# Altium schematic sheet CPU-board-Sheet3-multi.SchDoc
size A3; SheetNumber: 3
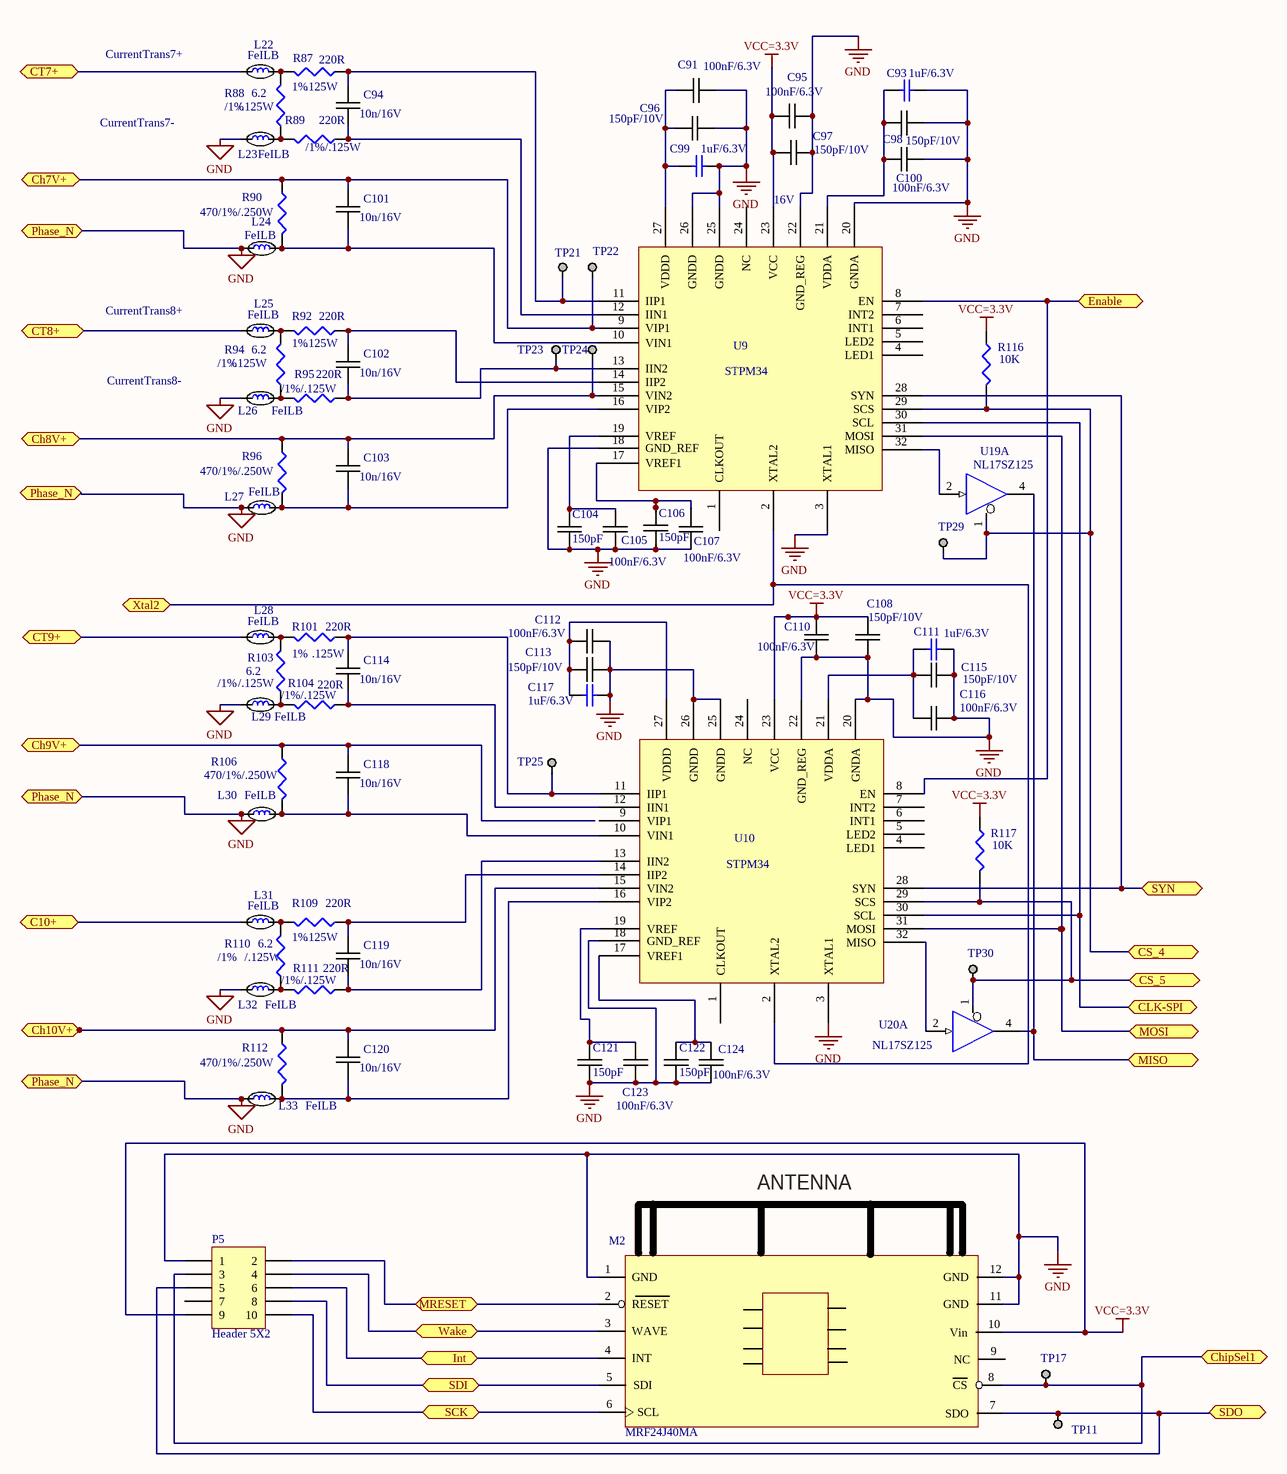
[diagram p0: CPU-board-Sheet3-multi.SchDoc]

## Parts
C91  100nF/6.3V  [0402C-GENERIC]
C93  1uF/6.3V  [0402C-GENERIC]
C94  10n/16V  [0402C-GENERIC]
C95  100nF/6.3V  [0402C-GENERIC]
C96  150pF/10V  [0402C-GENERIC]
C97  150pF/10V  [0402C-GENERIC]
C98  150pF/10V  [0402C-GENERIC]
C99  1uF/6.3V  [0402C-GENERIC]
C100  100nF/6.3V  [0402C-GENERIC]
C101  10n/16V  [0402C-GENERIC]
C102  10n/16V  [0402C-GENERIC]
C103  10n/16V  [0402C-GENERIC]
C104  150pF  [0402C-GENERIC]
C105  100nF/6.3V  [0402C-GENERIC]
C106  150pF  [0402C-GENERIC]
C107  100nF/6.3V  [0402C-GENERIC]
C108  150pF/10V  [0402C-GENERIC]
C110  100nF/6.3V  [0402C-GENERIC]
C111  1uF/6.3V  [0402C-GENERIC]
C112  100nF/6.3V  [0402C-GENERIC]
C113  150pF/10V  [0402C-GENERIC]
C114  10n/16V  [0402C-GENERIC]
C115  150pF/10V  [0402C-GENERIC]
C116  100nF/6.3V  [0402C-GENERIC]
C117  1uF/6.3V  [0402C-GENERIC]
C118  10n/16V  [0402C-GENERIC]
C119  10n/16V  [0402C-GENERIC]
C120  10n/16V  [0402C-GENERIC]
C121  150pF  [0402C-GENERIC]
C122  150pF  [0402C-GENERIC]
C123  100nF/6.3V  [0402C-GENERIC]
C124  100nF/6.3V  [0402C-GENERIC]
L22  FeILB  [0603C-TBD]
L23  FeILB  [0603C-TBD]
L24  FeILB  [0603C-TBD]
L25  FeILB  [0603C-TBD]
L26  FeILB  [0603C-TBD]
L27  FeILB  [0603C-TBD]
L28  FeILB  [0603C-TBD]
L29  FeILB  [0603C-TBD]
L30  FeILB  [0603C-TBD]
L31  FeILB  [0603C-TBD]
L32  FeILB  [0603C-TBD]
L33  FeILB  [0603C-TBD]
M2  MRF24J40MA  [MRF24J40MA-zigBEE module]
P5  Header 5X2  [Header2x5 1.27mm pitch]
R87  220R  [0402R-TBD]
R88  6.2  [0402R-TBD]
R89  220R  [0402R-TBD]
R90  470/1%/.250W  [1206FB-GENERIC]
R92  220R  [0402R-TBD]
R94  6.2  [0402R-TBD]
R95  220R  [0402R-TBD]
R96  470/1%/.250W  [1206FB-GENERIC]
R101  220R  [0402R-TBD]
R103  6.2  [0402R-TBD]
R104  220R  [0402R-TBD]
R106  470/1%/.250W  [1206FB-GENERIC]
R109  220R  [0402R-TBD]
R110  6.2  [0402R-TBD]
R111  220R  [0402R-TBD]
R112  470/1%/.250W  [1206FB-GENERIC]
R116  10K  [0402C-GENERIC]
R117  10K  [0402C-GENERIC]
TP11  TESTPOINT  [TESTPOINT]  (value not drawn)
TP17  TESTPOINT  [TESTPOINT]  (value not drawn)
TP21  TESTPOINT  [TESTPOINT]  (value not drawn)
TP22  TESTPOINT  [TESTPOINT]  (value not drawn)
TP23  TESTPOINT  [TESTPOINT]  (value not drawn)
TP24  TESTPOINT  [TESTPOINT]  (value not drawn)
TP25  TESTPOINT  [TESTPOINT]  (value not drawn)
TP29  TESTPOINT  [TESTPOINT]  (value not drawn)
TP30  TESTPOINT  [TESTPOINT]  (value not drawn)
U9  STPM34  [QFN32_L]
U10  STPM34  [QFN32_L]
U19  NL17SZ125  (part A of 2)
U20  NL17SZ125  (part A of 2)

## Ports
C10+, Ch7V+, Ch8V+, Ch9V+, Ch10V+, ChipSel1, CLK-SPI, CS_4, CS_5, CT7+, CT8+, CT9+, Enable, Int, MISO, MOSI, MRESET, Phase_N, SCK, SDI, SDO, SYN, Wake, Xtal2

## Nets
GND: C91.2 C93.2 C95.2 C96.2 C97.2 C98.1 C99.2 C100.2 C104.2 C105.2 C106.2 C107.2 C108.2 C110.1 C111.2 C112.2 C113.2 C115.2 C116.2 C117.2 C121.2 C122.2 C123.2 C124.2 L23.1 L24.1 L26.1 L27.1 L29.1 L30.1 L32.1 L33.1 M2.1(GND) M2.11(GND) M2.12(GND) P5.1 U9.3(XTAL1) U9.18(GND_REF) U9.20(GNDA) U9.22(GND_REG) U9.25(GNDD) U9.26(GNDD) U10.3(XTAL1) U10.18(GND_REF) U10.20(GNDA) U10.22(GND_REG) U10.25(GNDD) U10.26(GNDD) ; port Phase_N
VCC=3.3V: C95.1 C97.1 C108.1 C110.2 M2.10(Vin) P5.9 R116.1 R117.1 U9.23(VCC) U10.23(VCC)
C10+: L31.1 ; port C10+
Ch7V+: C101.2 R90.1 TP22.1 U9.9(VIP1) ; port Ch7V+
Ch8V+: C103.2 R96.1 TP24.1 U9.15(VIN2) ; port Ch8V+
Ch9V+: C118.2 R106.1 ; port Ch9V+
Ch10V+: C120.2 R112.1 U10.15(VIN2) ; port Ch10V+
ChipSel1: M2.8(CS) P5.3 TP17.1 ; port ChipSel1
CLK-SPI: U9.30(SCL) U10.30(SCL) ; port CLK-SPI
CS_4: R116.2 TP29.1 U9.29(SCS) U19.1 ; port CS_4
CS_5: R117.2 TP30.1 U10.29(SCS) U20.1 ; port CS_5
CT7+: L22.1 ; port CT7+
CT8+: L25.1 ; port CT8+
CT9+: L28.1 ; port CT9+
Enable: U9.8(EN) U10.8(EN) ; port Enable
Int: M2.4(INT) P5.6 ; port Int
MISO: U19.4(Y) U20.4(Y) ; port MISO
MOSI: U9.31(MOSI) U10.31(MOSI) ; port MOSI
MRESET: M2.2(RESET) P5.2 ; port MRESET
SCK: M2.6(SCL) P5.10 ; port SCK
SDI: M2.5(SDI) P5.8 ; port SDI
SDO: M2.7(SDO) P5.5 TP11.1 ; port SDO
SYN: U9.28(SYN) U10.28(SYN) ; port SYN
Wake: M2.3(WAVE) P5.4 ; port Wake
Xtal2: U9.2(XTAL2) U10.2(XTAL2) ; port Xtal2
NetC91_1: C91.1 C96.1 C99.1 U9.27(VDDD)
NetC93_1: C93.1 C98.2 C100.1 U9.21(VDDA)
NetC94_1: C94.1 R89.1 U9.12(IIN1)
NetC94_2: C94.2 R87.1 TP21.1 U9.11(IIP1)
NetC101_1: C101.1 L24.2 R90.2 U9.10(VIN1)
NetC102_1: C102.1 R95.1 TP23.1 U9.13(IIN2)
NetC102_2: C102.2 R92.1 U9.14(IIP2)
NetC103_1: C103.1 L27.2 R96.2 U9.16(VIP2)
NetC104_1: C104.1 C105.1 U9.19(VREF)
NetC106_1: C106.1 C107.1 U9.17(VREF1)
NetC111_1: C111.1 C115.1 C116.1 U10.21(VDDA)
NetC112_1: C112.1 C113.1 C117.1 U10.27(VDDD)
NetC114_1: C114.1 R104.1 U10.12(IIN1)
NetC114_2: C114.2 R101.1 TP25.1 U10.11(IIP1)
NetC118_1: C118.1 L30.2 R106.2 U10.10(VIN1)
NetC119_1: C119.1 R111.1 U10.13(IIN2)
NetC119_2: C119.2 R109.1 U10.14(IIP2)
NetC120_1: C120.1 L33.2 R112.2 U10.16(VIP2)
NetC121_1: C121.1 C123.1 U10.19(VREF)
NetC122_1: C122.1 C124.1 U10.17(VREF1)
NetL22_2: L22.2 R87.2 R88.2
NetL23_2: L23.2 R88.1 R89.2
NetL25_2: L25.2 R92.2 R94.2
NetL26_2: L26.2 R94.1 R95.2
NetL28_2: L28.2 R101.2 R103.2
NetL29_2: L29.2 R103.1 R104.2
NetL31_2: L31.2 R109.2 R110.2
NetL32_2: L32.2 R110.1 R111.2
NetU9_32: U9.32(MISO) U19.2(B)
NetU10_32: U10.32(MISO) U20.2(B)

Not connected (* = marked no-connect by the designer): M2 9(NC); P5 7; U9 1(CLKOUT) 4(LED1) 5(LED2) 6(INT1) 7(INT2) 24(NC); U10 1(CLKOUT) 4(LED1) 5(LED2) 6(INT1) 7(INT2) 9(VIP1) 24(NC)

## Notes on the sheet
- CurrentTrans7+
- 1%
- .125W
- CurrentTrans7-
- /1%
- (near R88) /.125W
- (near R89) /1%/.125W
- 16V
- CurrentTrans8+
- (near R94) /.125W
- (near R92) .125W
- CurrentTrans8-
- /1%/.125W
- (near L29) /1%
- /.125W
- (near R110) /.125W
- (in symbol MRF24J40MA) ANTENNA

## Library data of the parts
C91 C95 C100 C105 C107 C110 C112 C116 C123 C124 = 0805C-18PF-50V-C0G-JOH: CAPACITOR 0805 CERAMIC; mfr PN: LMK105BJ104KV-F; Manufacturer: Taiyo Yuden; Mfr.PN#: CRM155R71H103KA880; Value: 100nF/16V; Suppl.PN#: 587-1227-1-ND; Supplier 1: Digi-Key; Supplier Part Number 1: 709-1171-2-ND; Package reference: 0805-TBD; Supplier: Digi-Key; PackageReference: 0402; Price: .002
C93 C99 C111 C117 = Cap: Capacitor; Manufacturer: Murata; Mfr.PN#: GRM155R60J105KE19D; Value: 1uF; Suppl.PN#: 490-1320-1-ND; Published: 8-Jun-2000; LatestRevisionDate: 17-Jul-2002; LatestRevisionNote: Re-released for DXP Platform.; PackageReference: 0402; Publisher: Altium Limited; PackageDescription: Radial Cap, Thru-Hole; 2 Leads; 0.3 in Pin Spacing; Supplier: DigiKey
C94 C101-C103 C114 C118-C120 = 0805C-18PF-50V-C0G-JOH: CAPACITOR 0805 CERAMIC; Manufacturer: Murata Electronics; Mfr.PN#: GRM155R71C103KA01D; Value: 10n; Suppl.PN#: 490-1313-1-ND; Supplier 1: Digi-Key; Supplier Part Number 1: 709-1171-2-ND; mfr PN: *; PackageReference: 0402; Supplier: Digi-Key; Suppl.PN#: GRM155R71C103KA01D; smd: 0402; Price: .002
C96-C98 C108 C113 C115 = 0805C-18PF-50V-C0G-JOH: CAPACITOR 0805 CERAMIC; Manufacturer: Wurth Electronics; Mfr.PN#: 885012005014; Suppl.PN#: 732-7432-1-ND; Supplier 1: Digi-Key; Supplier Part Number 1: 709-1171-2-ND; Value: 150pF/10V; mfr PN: *; Supplier: Digi-Key; Price: .002
  C96 C113 C115: Package reference: 0805-TBD; PackageReference: 0402
  C97 C98: PackageReference: 0402; smd: 0402
  C108: Package reference: 0805-TBD; smd: 0402
C104 C106 C121 C122 = 0805C-18PF-50V-C0G-JOH: CAPACITOR 0805 CERAMIC; Manufacturer: Wurth Electronics; Mfr.PN#: 885012005014; Value: 150pF/10V; Suppl.PN#: 732-7432-1-ND; Supplier 1: Digi-Key; Supplier Part Number 1: 709-1171-2-ND; mfr PN: *; PackageReference: 0402; Supplier: Digi-Key; smd: 0402; Price: .002
L22-L33 = FerrBeads/ILBB: Manufacturer: Brand Samsung; Mfr.PN#: C1M10J152NC; Suppl.PN#: 1276-6326-1-ND; Supplier: Digi-Key; Price: .027
M2 = MRF24J40MA: Manufacturer: Microchip; Mfr.PN#: MRF24J40MDT-I/RM; Suppl.PN#: MRF24J40MDT-I/RMCT-ND; Supplier: Digi-Key; Price: 6.08
P5 = Header 5X2: Header, 5-Pin, Dual row; Manufacturer: Samtec Inc; Mfr.PN#: FTSH-105-01-L-D-K; Suppl.PN#: SAM8798-ND; LatestRevisionDate: 17-Jul-2002; LatestRevisionNote: Re-released for DXP Platform.; Publisher: Altium Limited; Supplier: Digikey
R87 R89 R92 R95 R101 R104 R109 R111 = Res3: Resistor; Manufacturer: Panasonic; Mfr.PN#: ERJ-2RKF1001X; Value: 1K; Suppl.PN#: P1.00KLCT-ND; Published: 8-Jun-2000; LatestRevisionDate: 29-May-2009; LatestRevisionNote: IPC-7351 Footprint Added.; PackageReference: 0402; Publisher: Altium Limited; PackageDescription: Chip Resistor; Supplier: DigiKey; Price: .0035
R88 R94 R103 R110 = Res3: Resistor; Manufacturer: Vishay Dale; Mfr.PN#: CRCW04026R20FKED; Value: 18.7 1%; Suppl.PN#: 541-6.20LLCT-ND; Published: 8-Jun-2000; LatestRevisionDate: 29-May-2009; LatestRevisionNote: IPC-7351 Footprint Added.; PackageReference: 0402; Publisher: Altium Limited; PackageDescription: Chip Resistor; Supplier: Digi-Key; Price: .05; SMD: 0402
R90 R96 R106 R112 = Res3: Resistor; Manufacturer: Vishay/Draloric; Mfr.PN#: SMM02040C4700FB300; Value: 470 1%/.250W; Suppl.PN#: 71-SMM0204-F-470; Published: 8-Jun-2000; LatestRevisionDate: 29-May-2009; LatestRevisionNote: IPC-7351 Footprint Added.; Publisher: Altium Limited; PackageDescription: Chip Resistor; Supplier: Mouser; SMD: 1206; Price: .02; PackageReference: 1206
R116 R117 = Res3: Resistor; Manufacturer: Panasonic; Mfr.PN#: ERJ-2RKF1002X; Value: 10k/1%/.125W; Suppl.PN#: P10.0KLCT-ND; Published: 8-Jun-2000; LatestRevisionDate: 29-May-2009; LatestRevisionNote: IPC-7351 Footprint Added.; Publisher: Altium Limited; PackageDescription: Chip Resistor; Supplier: Digikey; SMD: 0402; Price: .02; PackageReference: 0402
TP11 TP17 TP21-TP25 TP29 = TESTPOINT: TESTPOINT SCOPE GRABBER; Manufacturer Part Number: 5010; Manufacturer: Keystone Electronics; Reel: TH; Supplier 1: Digi-Key; Supplier Part Number 1: 5010K-ND
TP30 = TESTPOINT: TESTPOINT SCOPE GRABBER; Mfr.PN#: S2761-46R; Manufacturer: Harwing Inc; Reel: TH; Supplier 1: Digi-Key; Supplier Part Number 1: 5010K-ND
U19 U20 = NL17SZ125: Tristate Single Buffer; Manufacturer: ON Semi; Mfr.PN#: NL17SZ125DTT1G; Suppl.PN#: NL17SZ125DTT1GOSCT-ND; Supplier: Digikey; Footprint: TSOP-5 case 483